# EAGLE design Dual_filter_common_mode_and_differential_300mA (EAGLE 7.7.0)
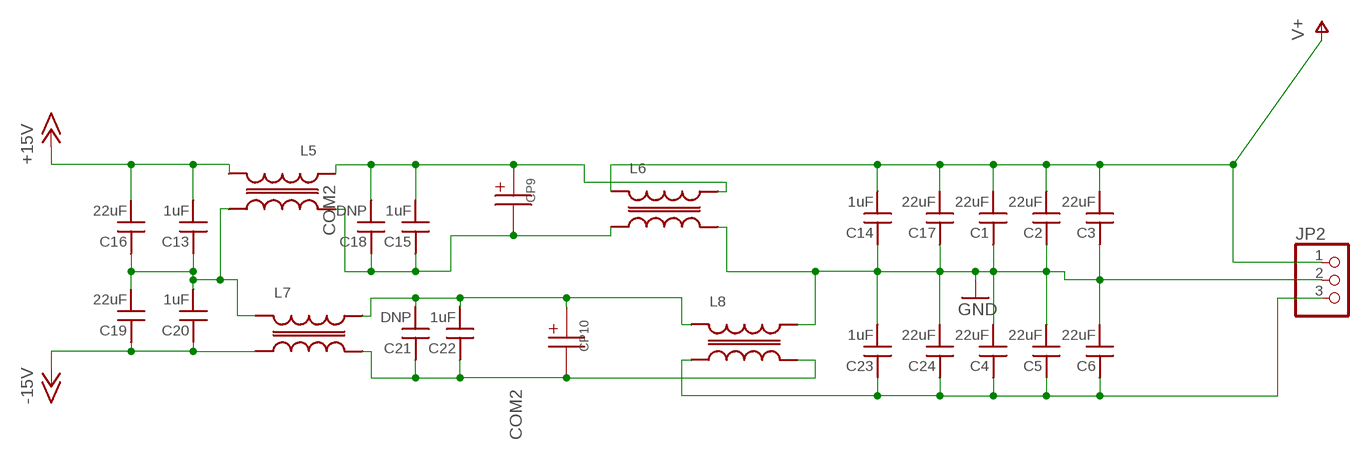
[diagram p0: schematic, sheet 1]

## Parts
C1  22uF  C_MLCC_SMDCMLCC_0805  [C_MLCC_0805]
C2  22uF  C_MLCC_SMDCMLCC_0805  [C_MLCC_0805]
C3  22uF  C_MLCC_SMDCMLCC_0805  [C_MLCC_0805]
C4  22uF  C_MLCC_SMDCMLCC_0805  [C_MLCC_0805]
C5  22uF  C_MLCC_SMDCMLCC_0805  [C_MLCC_0805]
C6  22uF  C_MLCC_SMDCMLCC_0805  [C_MLCC_0805]
C13  1uF  C_MLCC_SMDCMLCC_0805  [C_MLCC_0805]
C14  1uF  C_MLCC_SMDCMLCC_0805  [C_MLCC_0805]
C15  1uF  C_MLCC_SMDCMLCC_0805  [C_MLCC_0805]
C16  22uF  C_MLCC_SMDCMLCC_0805  [C_MLCC_0805]
C17  22uF  C_MLCC_SMDCMLCC_0805  [C_MLCC_0805]
C18  DNP  C_MLCC_SMDCMLCC_0805  [C_MLCC_0805]
C19  22uF  C_MLCC_SMDCMLCC_0805  [C_MLCC_0805]
C20  1uF  C_MLCC_SMDCMLCC_0805  [C_MLCC_0805]
C21  DNP  C_MLCC_SMDCMLCC_0805  [C_MLCC_0805]
C22  1uF  C_MLCC_SMDCMLCC_0805  [C_MLCC_0805]
C23  1uF  C_MLCC_SMDCMLCC_0805  [C_MLCC_0805]
C24  22uF  C_MLCC_SMDCMLCC_0805  [C_MLCC_0805]
CP9  CAP-POLPANASONIC_F  [PANASONIC_F]
CP10  CAP-POLPANASONIC_F  [PANASONIC_F]
JP2  PINHD-1X3  [1X03]
L5  MSD7342  [MSD7342]
L6  MSD7342  [MSD7342]
L7  MSD7342  [MSD7342]
L8  MSD7342  [MSD7342]

## Nets
+15V2: C13.P$2 C16.P$2 L5.4 ; supply symbol labelled +15V
-15V2: C19.P$1 C20.P$1 L7.1 ; supply symbol labelled -15V
COM2: C13.P$1 C16.P$1 C19.P$2 C20.P$2 L5.3 L7.2
GND2: C1.P$1 C2.P$1 C3.P$1 C4.P$2 C5.P$2 C6.P$2 C14.P$1 C17.P$1 C23.P$2 C24.P$2 JP2.2 L6.3 L8.4 ; supply symbol labelled GND
N$6: C15.P$2 C18.P$2 CP9.+ L5.2 L6.4
N$7: C15.P$1 C18.P$1 CP9.- L5.1 L6.1
N$9: C21.P$2 C22.P$2 CP10.+ L7.4 L8.2
N$10: C21.P$1 C22.P$1 CP10.- L7.3 L8.3
N$13: C4.P$1 C5.P$1 C6.P$1 C23.P$1 C24.P$1 JP2.3 L8.1
V+2: C1.P$2 C2.P$2 C3.P$2 C14.P$2 C17.P$2 JP2.1 L6.2 ; supply symbol labelled V+

## Library data of the parts
C1-C6 C16 C17 C19 C24 = jqi_passives:C_MLCC_SMD; DIGIKEY: 445-9112-1-ND
C13-C15 C20 C22 C23 = jqi_passives:C_MLCC_SMD; DIGIKEY: 587-5018-1-ND
C18 C21 = jqi_passives:C_MLCC_SMD
CP9 CP10 = rlc-jqi:CAP-POL: Polarized SMT Capacitor
JP2 = pinhead:PINHD-1X3: PIN HEADER; DIGIKEY: WM4201-ND
L5-L8 = coilcraft-jqi:MSD7342: MSD1260 series 1:1 coupled inductors; COILCRAFT: MSD7342-684MLB

## Board
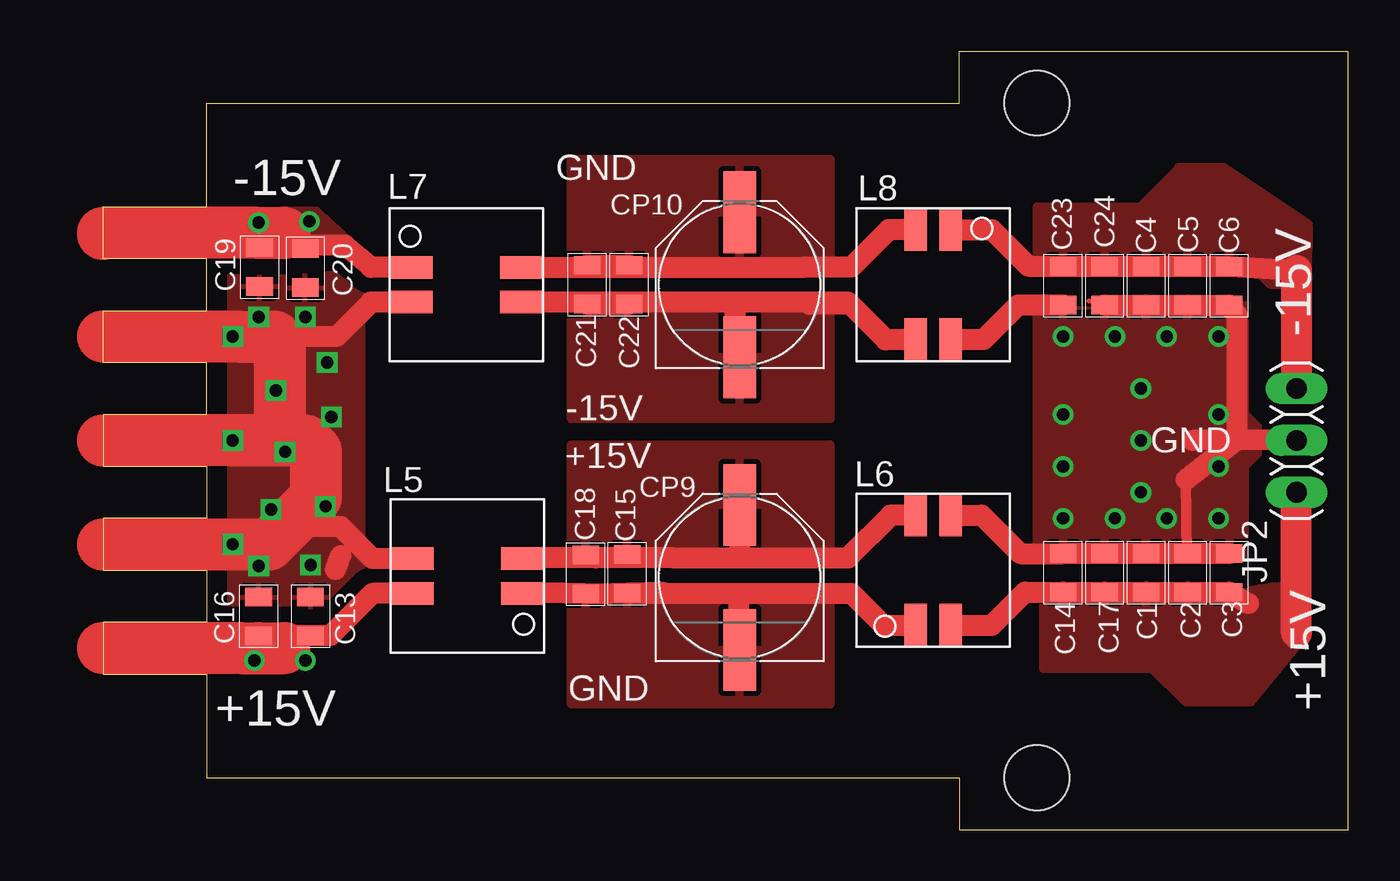
[diagram p1: board, top side]
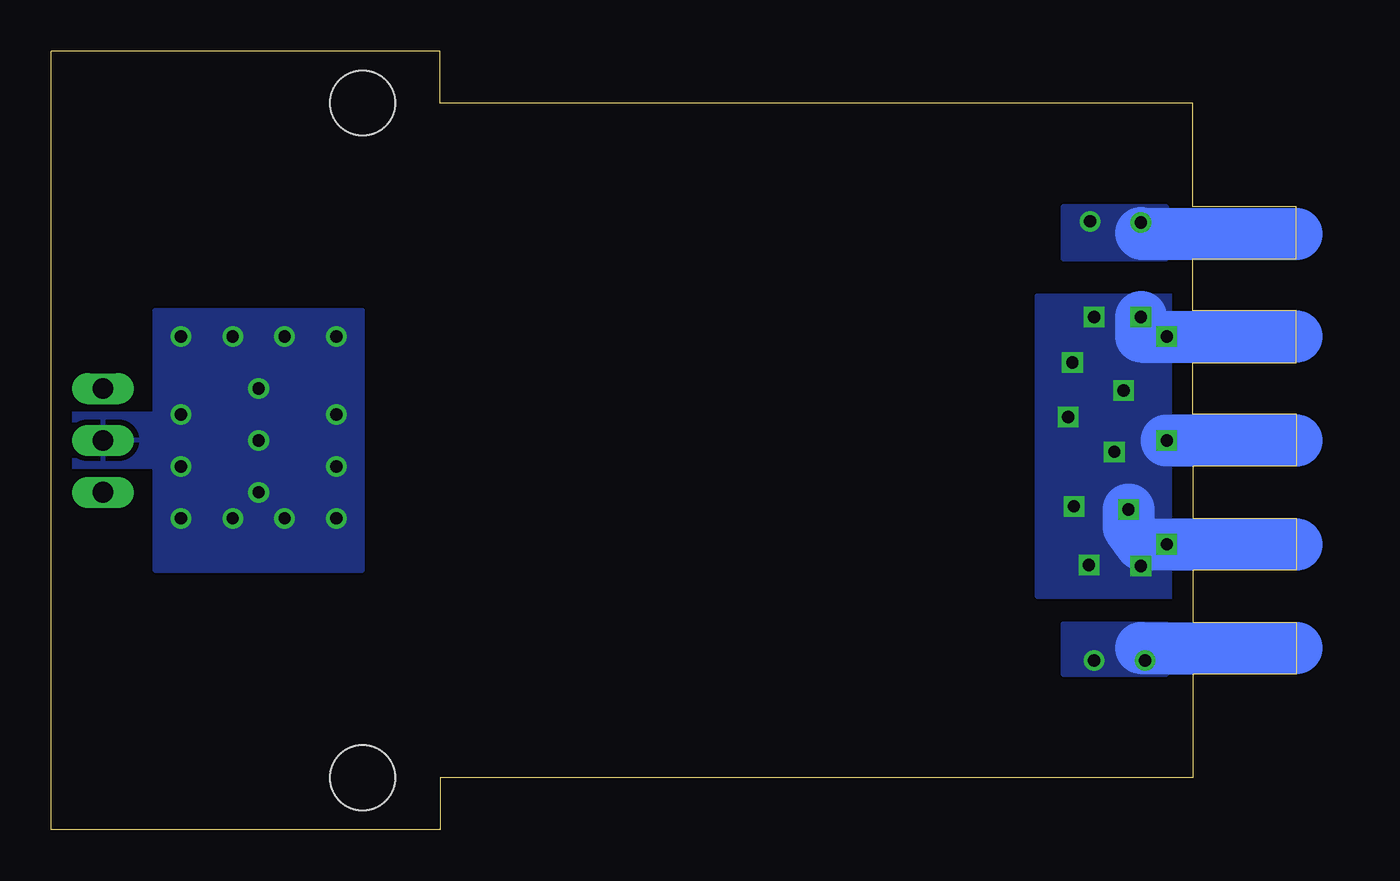
[diagram p2: board, bottom side, seen from below]

Size 60.96 x 38.1 mm. Coordinates in mm from the lower left corner, seen from the top.
Outline: 0,20.32 0,17.78 5.08,17.78 5.08,15.24 0,15.24 0,12.7 5.08,12.7 5.08,10.16 0,10.16 0,7.62 5.08,7.62 5.08,2.54 41.91,2.54 41.91,0 60.96,0 60.96,38.1 41.91,38.1 41.91,35.56 5.08,35.56 5.08,30.48 0,30.48 0,27.94 5.08,27.94 5.08,25.4 0,25.4 0,22.86 5.08,22.86 5.08,20.32 0,20.32
Copper layers (1*16): Top 0.035mm / dielectric 1.5mm / Bottom 0.035mm
Design rules "default *": minimum track width 10mil, minimum drill 0.6mm, track to track 8mil, track to pad 8mil, pad to pad 8mil, via to via 8mil, smd to smd 8mil, copper to edge 40mil, drill to drill 8mil, minimum pad ring 10mil, minimum via ring 8mil, stop-mask expansion 4mil, vias tented up to drill 0mil, thermal gap 10mil
Holes 3.17 mm at 45.72,35.56 45.72,2.54

### Footprints (pad centres in the part's own frame; a part is rotated, then mirrored left to right if it is on the bottom)
C_MLCC_0805 = smd 0.9 x 1.3: P$1 -0.95,0; P$2 0.95,0
PANASONIC_F = smd 4 x 1.6: + 3.55,0; - -3.55,0
1X03 = drill 1.016 long: 1 -2.54,0; 2 0,0; 3 2.54,0
MSD7342 = smd 2.1 x 1.1: 1 -2.7,0.85; 2 -2.7,-0.85; 3 2.7,-0.85; 4 2.7,0.85

### Placement (x,y rotation side)
C1  51.05,12.57 270 top
C2  53.09,12.57 270 top
C3  55.12,12.57 270 top
C4  51.05,26.62 270 top
C5  53.09,26.62 270 top
C6  55.12,26.62 270 top
C13  10.16,10.44 270 top
C14  46.99,12.57 270 top
C15  25.65,12.52 90 top
C16  7.62,10.44 270 top
C17  49.02,12.57 270 top
C18  23.62,12.5 90 top
C19  7.67,27.53 270 top
C20  9.91,27.48 270 top
C21  23.7,26.67 90 top
C22  25.76,26.67 90 top
C23  46.99,26.62 270 top
C24  49.02,26.62 270 top
CP9  31.17,12.34 90 top
CP10  31.17,26.67 90 top
JP2  58.42,19.05 90 top
L5  17.83,12.42 180 top
L6  40.64,12.7 90 top
L7  17.78,26.67 0 top
L8  40.64,26.67 270 top

### Tracks (layer width: path | path; a pad name or v marks a point on that pad's centre or on a via)
15V2
  pour Top: 6.2,8.13 9.8,8.13 11.02,9.35 6.96,9.35 6.65,9.04
+15V2  (via drill 0.6)
  Top 0.406: 4.81,8.93 3.81,8.93 6.35,8.89 | 9.35,9.5 8.89,9.5 8.89,9.44
  Top 0.508: C13.P$2 8.76,9.08 8.76,8.93 | C16.P$2 9.02,9.08 9.02,8.93 | 8.89,8.89 9.4,8.89
  Top 1.016: 9.02,8.93 8.76,8.93 6.73,8.89 4.81,8.93 3.05,8.93 3.05,8.89 | 8.89,9.44 7.62,8.89 7.42,8.89 v7.42,8.28 | L5.4 13.2,11.57 11.12,9.5 9.35,9.5 9.35,8.39
  Top 2.54: 6.35,8.89 0,8.89 | 6.73,8.89 7.62,8.89 8.89,8.89
  Bottom 2.54: 7.62,8.89 0,8.89
  other vias: 9.91,8.28
  pour Bottom: 6.35,10.06 11.43,10.06 11.43,7.62 6.35,7.62
-15V2  (via drill 0.6)
  Top 0.254: 9.96,28.6 9.91,28.6 C20.P$1
  Top 0.508: 8.8,28.69 arc-90 7.62,29.21 | 8.89,29.21 9.96,28.6 | 10.67,28.35 C20.P$1
  Top 1.016: L7.1 13.12,27.52 11.84,28.6 9.96,28.6 | C19.P$1 7.62,28.48 7.62,29.21
  Top 2.54: 0,29.16 arc-90 0.05,29.21 7.62,29.21 8.89,29.21
  Bottom 0.254: v7.62,29.72 7.62,29.21
  Bottom 2.54: 7.62,29.21 7.57,29.16 0,29.16
  other vias: 10.11,29.77
  pour Top (no thermals): 12.29,28.7 10.46,30.35 8.69,30.35 8.23,30.07 8.23,29.77 9.55,28.45
  pour Bottom: 6.35,27.94 6.35,30.48 11.43,30.48 11.43,27.94
COM2  (via drill 0.6)
  Top 1.016: 11.38,12.72 11.64,13.42 | L7.2 13.12,25.82 11.43,24.13 7.62,24.13 | L5.3 13.2,13.27 11.63,14.83 10,14.83
  Top 1.524: 7.11,24.13 6.6,24.13
  Top 2.54: 0,24.13 6.6,24.13 8.38,24.13 8.64,23.88 8.64,19.81 7.87,19.05 v6.35,19.05 | v6.35,19.05 0,19.05 | v6.35,19.05 9.91,19.05 10.41,18.54 10.41,16.26 8.13,13.97 0,13.97
  Bottom 2.54: v7.62,25.09 7.62,24.13 0,24.13 | v6.35,19.05 0,19.05 | v8.23,15.67 8.23,14.81 7.62,13.97 0,13.97
  other vias: 9.91,25.1 10.97,22.86 11.18,20.19 10.16,12.95 7.62,12.9 8.92,18.49 8.46,21.49 10.9,15.82 6.35,24.13 6.35,13.97
  pour Top (isolate 0.762): 0,33.02 12.7,33.02 12.7,5.08 0,5.08
  pour Bottom (isolate 0.762): 0,26.11 12.7,26.11 12.7,11.43 0,11.43
GND2  (via drill 0.6)
  Top 0.254: C4.P$2 48.26,25.87 | C3.P$1 53.05,13.36 51.6,13.36 C2.P$1
  Top 0.508: 53.05,13.36 53.01,17.13
  Top 1.016: C3.P$1 C2.P$1 C1.P$1 C17.P$1 C14.P$1 44.91,13.51 43.02,15.4 L6.3 | JP2.2 58.22,18.85 58.01,19.05 55.5,19.07 | C24.P$2 C4.P$2 C5.P$2 C6.P$2 55.5,25.21 55.5,19.07 | L8.4 43.1,23.98 44.81,25.68 C23.P$2 | 55.5,19.07 53.34,19.05 | 53.01,17.13 55.5,19.07
  other vias: 46.99,24.13 49.53,24.13 52.07,24.13 54.61,24.13 54.61,15.24 52.07,15.24 49.53,15.24 46.99,15.24 46.99,20.32 50.8,19.05 54.61,17.78 54.61,20.32 46.99,17.78 50.8,21.59 50.8,16.51
  pour Top: 45.72,25.4 53.34,25.4 55.88,25.73 55.88,20.32 57.15,19.05 55.88,17.78 55.85,13.49 53.42,13.77 45.72,13.97
  pour Bottom: 45.72,25.4 55.88,25.4 55.88,20.32 60.96,20.32 60.96,17.78 55.88,17.78 55.88,12.7 45.72,12.7
N$6
  Top 0.508: C18.P$2 24.3,13.31 24.13,13.31 | C15.P$2 27.72,13.31 27.94,13.31
  Top 1.016: L6.4 38.56,15.4 36.47,13.31 27.94,13.31 24.13,13.31 20.44,13.31 20.48,13.27 L5.2 | CP9.+ 31.17,13.36
  pour Top: 22.91,13.77 22.91,18.85 35.61,18.85 35.61,13.77
N$7
  Top 1.016: L6.1 39.37,10.01 38.2,10.01 36.64,11.57 C15.P$1 27.43,11.62 C18.P$1 20.56,11.62 20.56,11.6 L5.1 | CP9.- 31.14,8.79 31.14,11.4
  pour Top: 22.91,6.15 22.91,11.23 35.61,11.23 35.61,6.15
N$9
  Top 1.016: L7.4 24.13,27.52 | 24.13,27.52 34.29,27.52 34.3,27.53 36.63,27.53 38.46,29.37 L8.2 | 24.13,27.52 C21.P$2 C22.P$2
  pour Top: 22.91,27.74 22.91,32.82 35.61,32.82 35.61,27.74
N$10
  Top 1.016: 30.48,25.82 36.46,25.82 36.58,25.7 | 30.48,25.82 L7.3 24.03,25.82 C21.P$1 C22.P$1 | L8.3 38.31,23.97 36.58,25.7 | 36.58,25.7 34.59,25.7 | CP10.- 30.94,25.36 arc90 30.48,25.82
  pour Top: 22.91,20.12 22.91,25.2 35.61,25.2 35.61,20.12
N$12
  cutout Top: 13.92,16.26 22.25,16.26 22.25,8.08 13.92,8.08
  cutout Top: 36.83,17.07 45.21,17.07 45.21,8.69 36.83,8.69
  cutout Top: 13.67,30.84 22,30.84 22,22.45 13.67,22.45
  cutout Top: 36.53,30.84 44.86,30.84 44.86,22.45 36.53,22.45
N$13
  Top 1.016: L8.1 43.5,29.37 45.29,27.58 46.97,27.58 C23.P$1 C24.P$1 C4.P$1 C5.P$1 C6.P$1 58.42,27.37
  Top 1.524: 58.42,27.37 JP2.3
  pour Top: 58.98,26.92 59,29.64 54.86,32.41 52.63,32.41 52.63,32.31 50.8,30.48 45.72,30.48 45.72,27.94 55.88,27.94 57.15,26.67 58.8,26.64
V+2
  Top 1.016: 56.07,11.06 C3.P$2 C2.P$2 C1.P$2 C17.P$2 C14.P$2 46.98,11.63 45.14,11.63 43.5,10 L6.2
  Top 1.524: 58.42,9.63 JP2.1
  pour Top: 58.78,11.79 58.78,9.4 56.18,6.25 53.04,6.25 51.36,7.87 46.02,7.87 46.02,11.48 55.17,11.58 57.38,11.91

### Text on the board
tPlace: -15V | GND | -15V | -15V | GND | +15V | GND | +15V | +15V